# EAGLE schematic BidirectionalBusCape (EAGLE 9.6.1)

## Sheet 1 of 2
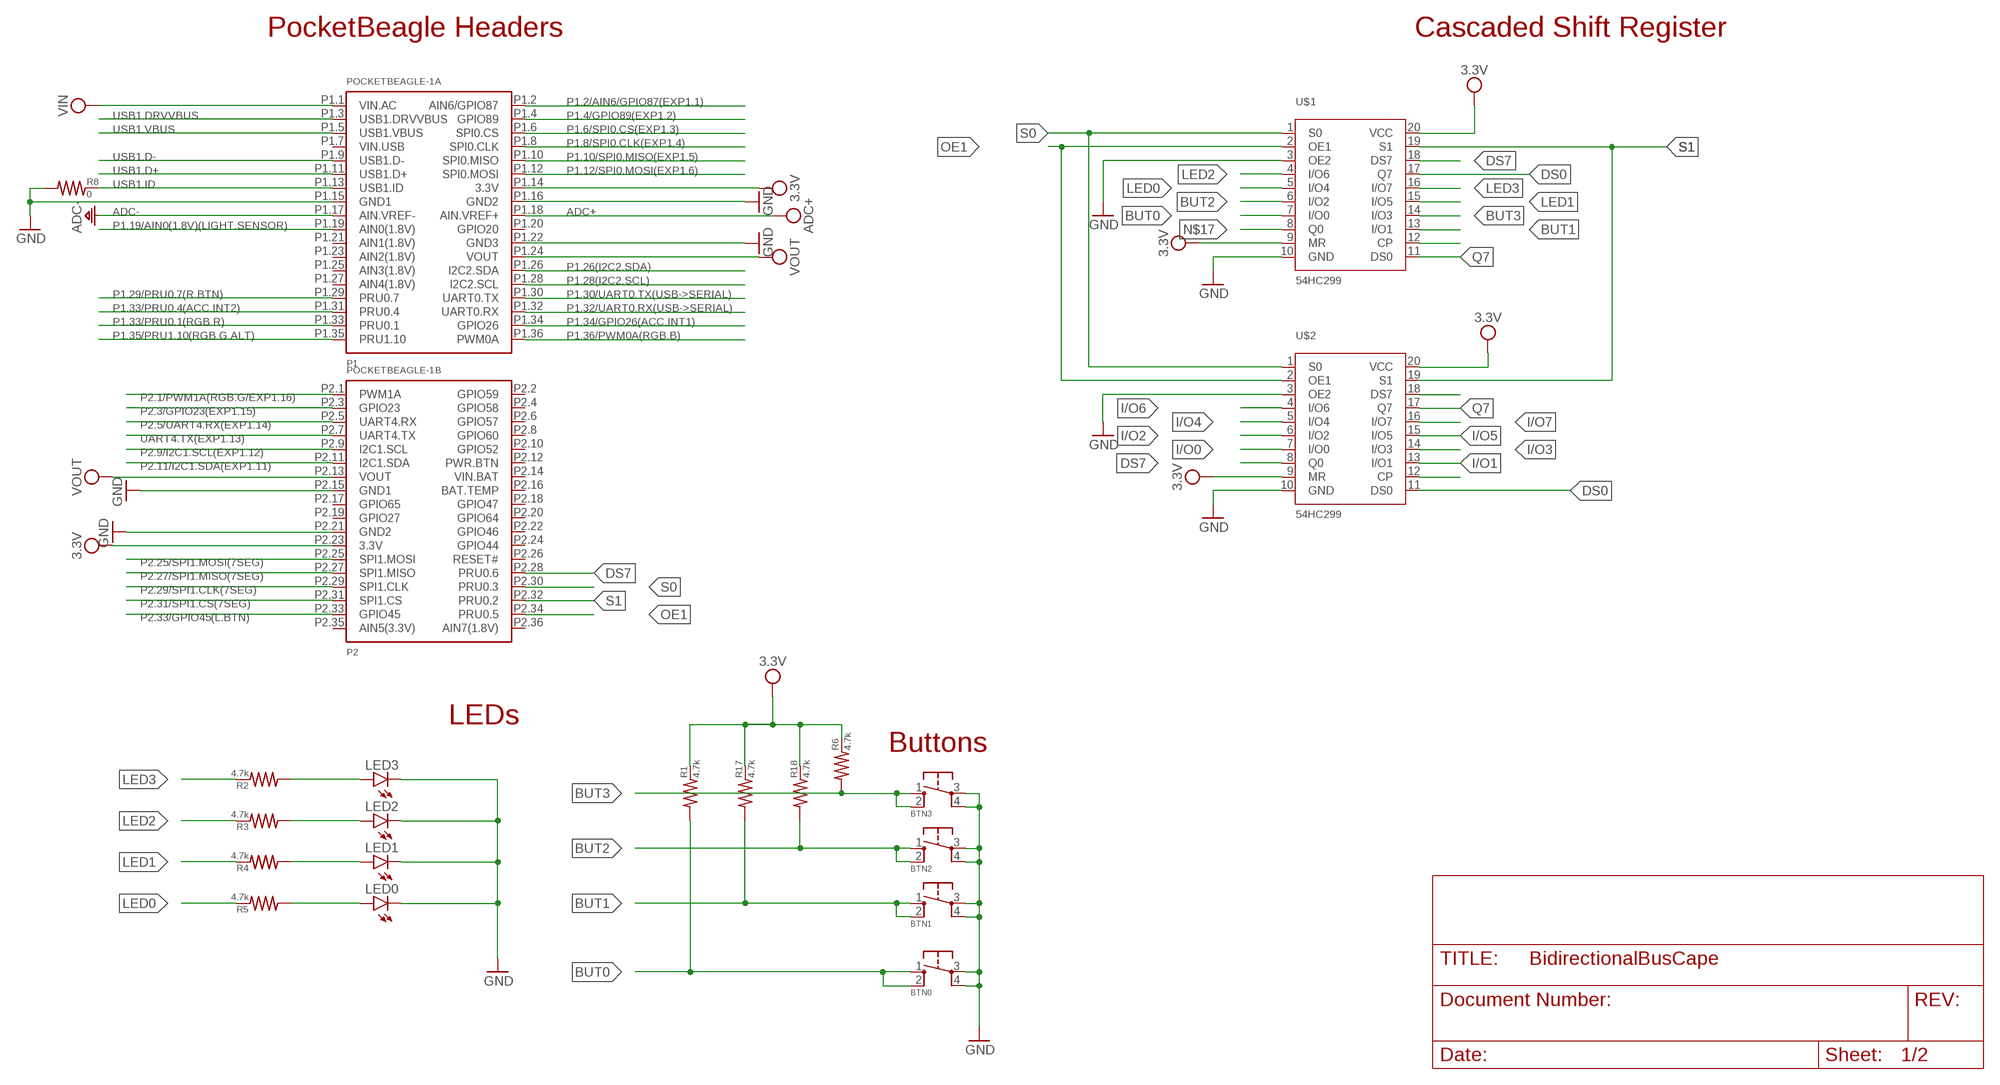
[diagram p0: schematic, sheet 1]

### Parts
BTN0  TACTILE.SWITCH-6MM  [6MM_TACTILE-SWITCH]
BTN1  TACTILE.SWITCH-6MM  [6MM_TACTILE-SWITCH]
BTN2  TACTILE.SWITCH-6MM  [6MM_TACTILE-SWITCH]
BTN3  TACTILE.SWITCH-3X3.5MM  [3X3.5MM-TACTILE-SWITCH]
LED0  LEDCHIPLED_0603  [CHIPLED_0603]
LED1  LEDCHIPLED_0603  [CHIPLED_0603]
LED2  LEDCHIPLED_0603  [CHIPLED_0603]
LED3  LEDCHIPLED_0603  [CHIPLED_0603]
POCKETBEAGLE-1  POCKETBEAGLE-(ORIGIN-CENTER)-SMT.PADS(ONLY)-NO.RESTRICT  [POCKETBEAGLE-(ORIGIN-CENTER)-SMT.PADS(ONLY)-NO.RESTRICT]
R1  4.7k  RESISTOR-(INCH)-0402  [0402]
R2  4.7k  RESISTOR-(INCH)-0402  [0402]
R3  4.7k  RESISTOR-(INCH)-0402  [0402]
R4  4.7k  RESISTOR-(INCH)-0402  [0402]
R5  4.7k  RESISTOR-(INCH)-0402  [0402]
R6  4.7k  RESISTOR-(INCH)-0402  [0402]
R8  0  RESISTOR-(INCH)-0402  [0402]
R17  4.7k  RESISTOR-(INCH)-0402  [0402]
R18  4.7k  RESISTOR-(INCH)-0402  [0402]
U$1  54HC299  [DIP254P762X508-20P]
U$2  54HC299  [DIP254P762X508-20P]

### Nets
3.3V: POCKETBEAGLE-1.P1.14(A:3.3V) POCKETBEAGLE-1.P2.23(B:3.3V) R1.2 R6.2 R17.2 R18.2 U$1.9(MR) U$1.20(VCC) U$2.9(MR) U$2.20(VCC)
ADC+: POCKETBEAGLE-1.P1.18(A:AIN.VREF+)
ADC-: POCKETBEAGLE-1.P1.17(A:AIN.VREF-)
BUT0: BTN0.1 BTN0.2 R1.1 U$1.7(I/O0)
BUT1: BTN1.1 BTN1.2 R17.1 U$1.13(I/O1)
BUT2: BTN2.1 BTN2.2 R18.1 U$1.6(I/O2)
BUT3: BTN3.1 BTN3.2 R6.1 U$1.14(I/O3)
DS0: U$1.17(Q7) U$2.11(DS0)
DS7: POCKETBEAGLE-1.P2.28(B:PRU0.6) U$1.18(DS7) U$2.8(Q0)
GND: BTN0.3 BTN0.4 BTN1.3 BTN1.4 BTN2.3 BTN2.4 BTN3.3 BTN3.4 LED0.C LED1.C LED2.C LED3.C POCKETBEAGLE-1.P1.15(A:GND1) POCKETBEAGLE-1.P1.16(A:GND2) POCKETBEAGLE-1.P1.22(A:GND3) POCKETBEAGLE-1.P2.15(B:GND1) POCKETBEAGLE-1.P2.21(B:GND2) R8.1 U$1.3(OE2) U$1.10(GND) U$2.3(OE2) U$2.10(GND)
I/O0: U$2.7(I/O0)
I/O1: U$2.13(I/O1)
I/O2: U$2.6(I/O2)
I/O3: U$2.14(I/O3)
I/O4: U$2.5(I/O4)
I/O5: U$2.15(I/O5)
I/O6: U$2.4(I/O6)
I/O7: U$2.16(I/O7)
LED0: R5.2 U$1.5(I/O4)
LED1: R4.2 U$1.15(I/O5)
LED2: R3.2 U$1.4(I/O6)
LED3: R2.2 U$1.16(I/O7)
N$2: LED3.A R2.1
N$3: LED2.A R3.1
N$4: LED1.A R4.1
N$5: LED0.A R5.1
N$17: U$1.8(Q0)
N$28: U$1.12(CP)
N$32: U$2.18(DS7)
N$38: U$2.12(CP)
OE1: POCKETBEAGLE-1.P2.34(B:PRU0.5) U$1.2(OE1) U$2.2(OE1)
P1.2/AIN6/GPIO87(EXP1.1): POCKETBEAGLE-1.P1.2(A:AIN6/GPIO87)
P1.4/GPIO89(EXP1.2): POCKETBEAGLE-1.P1.4(A:GPIO89)
P1.6/SPI0.CS(EXP1.3): POCKETBEAGLE-1.P1.6(A:SPI0.CS)
P1.8/SPI0.CLK(EXP1.4): POCKETBEAGLE-1.P1.8(A:SPI0.CLK)
P1.10/SPI0.MISO(EXP1.5): POCKETBEAGLE-1.P1.10(A:SPI0.MISO)
P1.12/SPI0.MOSI(EXP1.6): POCKETBEAGLE-1.P1.12(A:SPI0.MOSI)
P1.19/AIN0(1.8V)(LIGHT.SENSOR): POCKETBEAGLE-1.P1.19(A:AIN0(1.8V))
P1.26(I2C2.SDA): POCKETBEAGLE-1.P1.26(A:I2C2.SDA)
P1.28(I2C2.SCL): POCKETBEAGLE-1.P1.28(A:I2C2.SCL)
P1.29/PRU0.7(R.BTN): POCKETBEAGLE-1.P1.29(A:PRU0.7)
P1.30/UART0.TX(USB->SERIAL): POCKETBEAGLE-1.P1.30(A:UART0.TX)
P1.32/UART0.RX(USB->SERIAL): POCKETBEAGLE-1.P1.32(A:UART0.RX)
P1.33/PRU0.1(RGB.R): POCKETBEAGLE-1.P1.33(A:PRU0.1)
P1.33/PRU0.4(ACC.INT2): POCKETBEAGLE-1.P1.31(A:PRU0.4)
P1.34/GPIO26(ACC.INT1): POCKETBEAGLE-1.P1.34(A:GPIO26)
P1.35/PRU1.10(RGB.G.ALT): POCKETBEAGLE-1.P1.35(A:PRU1.10)
P1.36/PWM0A(RGB.B): POCKETBEAGLE-1.P1.36(A:PWM0A)
P2.1/PWM1A(RGB.G/EXP1.16): POCKETBEAGLE-1.P2.1(B:PWM1A)
P2.3/GPIO23(EXP1.15): POCKETBEAGLE-1.P2.3(B:GPIO23)
P2.5/UART4.RX(EXP1.14): POCKETBEAGLE-1.P2.5(B:UART4.RX)
P2.9/I2C1.SCL(EXP1.12): POCKETBEAGLE-1.P2.9(B:I2C1.SCL)
P2.11/I2C1.SDA(EXP1.11): POCKETBEAGLE-1.P2.11(B:I2C1.SDA)
P2.25/SPI1.MOSI(7SEG): POCKETBEAGLE-1.P2.25(B:SPI1.MOSI)
P2.27/SPI1.MISO(7SEG): POCKETBEAGLE-1.P2.27(B:SPI1.MISO)
P2.29/SPI1.CLK(7SEG): POCKETBEAGLE-1.P2.29(B:SPI1.CLK)
P2.31/SPI1.CS(7SEG): POCKETBEAGLE-1.P2.31(B:SPI1.CS)
P2.33/GPIO45(L.BTN): POCKETBEAGLE-1.P2.33(B:GPIO45)
Q7: U$1.11(DS0) U$2.17(Q7)
S0: POCKETBEAGLE-1.P2.30(B:PRU0.3) U$1.1(S0) U$2.1(S0)
S1: POCKETBEAGLE-1.P2.32(B:PRU0.2) U$1.19(S1) U$2.19(S1)
UART4.TX(EXP1.13): POCKETBEAGLE-1.P2.7(B:UART4.TX)
USB1.D+: POCKETBEAGLE-1.P1.11(A:USB1.D+)
USB1.D-: POCKETBEAGLE-1.P1.9(A:USB1.D-)
USB1.DRVVBUS: POCKETBEAGLE-1.P1.3(A:USB1.DRVVBUS)
USB1.ID: POCKETBEAGLE-1.P1.13(A:USB1.ID) R8.2
USB1.VBUS: POCKETBEAGLE-1.P1.5(A:USB1.VBUS)
VIN: POCKETBEAGLE-1.P1.1(A:VIN.AC)
VOUT: POCKETBEAGLE-1.P1.24(A:VOUT) POCKETBEAGLE-1.P2.13(B:VOUT)
Unconnected: POCKETBEAGLE-1.P1.7(A:VIN.USB) POCKETBEAGLE-1.P1.20(A:GPIO20) POCKETBEAGLE-1.P1.21(A:AIN1(1.8V)) POCKETBEAGLE-1.P1.23(A:AIN2(1.8V)) POCKETBEAGLE-1.P1.25(A:AIN3(1.8V)) POCKETBEAGLE-1.P1.27(A:AIN4(1.8V)) POCKETBEAGLE-1.P2.2(B:GPIO59) POCKETBEAGLE-1.P2.4(B:GPIO58) POCKETBEAGLE-1.P2.6(B:GPIO57) POCKETBEAGLE-1.P2.8(B:GPIO60) POCKETBEAGLE-1.P2.10(B:GPIO52) POCKETBEAGLE-1.P2.12(B:PWR.BTN) POCKETBEAGLE-1.P2.14(B:VIN.BAT) POCKETBEAGLE-1.P2.16(B:BAT.TEMP) POCKETBEAGLE-1.P2.17(B:GPIO65) POCKETBEAGLE-1.P2.18(B:GPIO47) POCKETBEAGLE-1.P2.19(B:GPIO27) POCKETBEAGLE-1.P2.20(B:GPIO64) POCKETBEAGLE-1.P2.22(B:GPIO46) POCKETBEAGLE-1.P2.24(B:GPIO44) POCKETBEAGLE-1.P2.26(B:RESET#) POCKETBEAGLE-1.P2.35(B:AIN5(3.3V)) POCKETBEAGLE-1.P2.36(B:AIN7(1.8V))

### Notes on the sheet
- PocketBeagle Headers | Cascaded Shift Register
- LEDs
- Buttons

## Sheet 2 of 2

## Library data of the parts
BTN0 BTN1-BTN3 = GHI-IOComponents:TACTILE.SWITCH-: 4 Lead Tactile Push Button Switches
LED0 LED1-LED3 = led:LED: LED OSRAM: - CHIPLED LG R971, LG N971, LY N971, LG Q971, LY Q971, LO R971, LY R971 LH N974, LH R974 LS Q976, LO Q976, LY Q976 LO Q996 - Hyper CHIPLED LW Q18S LB Q993, LB Q99A, LB R99A - SideLED LS A670, LO A670, LY A670, LG A670, LP A670 LB A673, LV A673, LT A673, LW A673 LH A674 LY A675 LS A676, LA A676, LO A676, LY A676, LW A676 LS A679, LY A679, LG A679 - Hyper Micro SIDELED® LS Y876, LA Y876, LO Y876, LY Y876 LT Y87S - SmartLED LW L88C, LW L88S LB L89C, LB L89S, LG L890 LS L89K, LO L89K, LY L89K LS L896, LA L896, LO L896, LY L896 - TOPLED LS T670, LO T670, LY T670, LG T670, LP T670 LSG T670, LSP T670, LSY T670, LOP T670, LYG T670 LG T671, LOG T671, LSG T671 LB T673, LV T673, LT T673, LW T673 LH T674 LS T676, LA T676, LO T676, LY T676, LB T676, LH T676, LSB T676, LW T676 LB T67C, LV T67C, LT T67C, LS T67K, LO T67K, LY T67K, LW E67C LS E67B, LA E67B, LO E67B, LY E67B, LB E67C, LV E67C, LT E67C LW T67C LS T679, LY T679, LG T679 LS T770, LO T770, LY T770, LG T770, LP T770 LB T773, LV T773, LT T773, LW T773 LH T774 LS E675, LA E675, LY E675, LS T675 LS T776, LA T776, LO T776, LY T776, LB T776 LHGB T686 LT T68C, LB T68C - Hyper Mini TOPLED® LB M676 - Mini TOPLED Santana® LG M470 LS M47K, LO M47K, LY M47K Source: http://www.osram.convergy.de LUXEON: - LUMILED® LXK2-PW12-R00, LXK2-PW12-S00, LXK2-PW14-U00, LXK2-PW14-V00 LXK2-PM12-R00, LXK2-PM12-S00, LXK2-PM14-U00 LXK2-PE12-Q00, LXK2-PE12-R00, LXK2-PE12-S00, LXK2-PE14-T00, LXK2-PE14-U00 LXK2-PB12-K00, LXK2-PB12-L00, LXK2-PB12-M00, LXK2-PB14-N00, LXK2-PB14-P00, LXK2-PB14-Q00 LXK2-PR12-L00, LXK2-PR12-M00, LXK2-PR14-Q00, LXK2-PR14-R00 LXK2-PD12-Q00, LXK2-PD12-R00, LXK2-PD12-S00 LXK2-PH12-R00, LXK2-PH12-S00 LXK2-PL12-P00, LXK2-PL12-Q00, LXK2-PL12-R00 Source: www.luxeon.com KINGBRIGHT: KA-3528ASYC Source: www.kingbright.com
POCKETBEAGLE-1 = GHI-Solutions:POCKETBEAGLE
R1-R6 R8 R17 R18 = GHI-BasicComponents:RESISTOR-(INCH)-: Basic SMD Resistors
U$1 U$2 = CD54HC299:54HC299